# Altium schematic sheet cm4gateway.SchDoc
size D
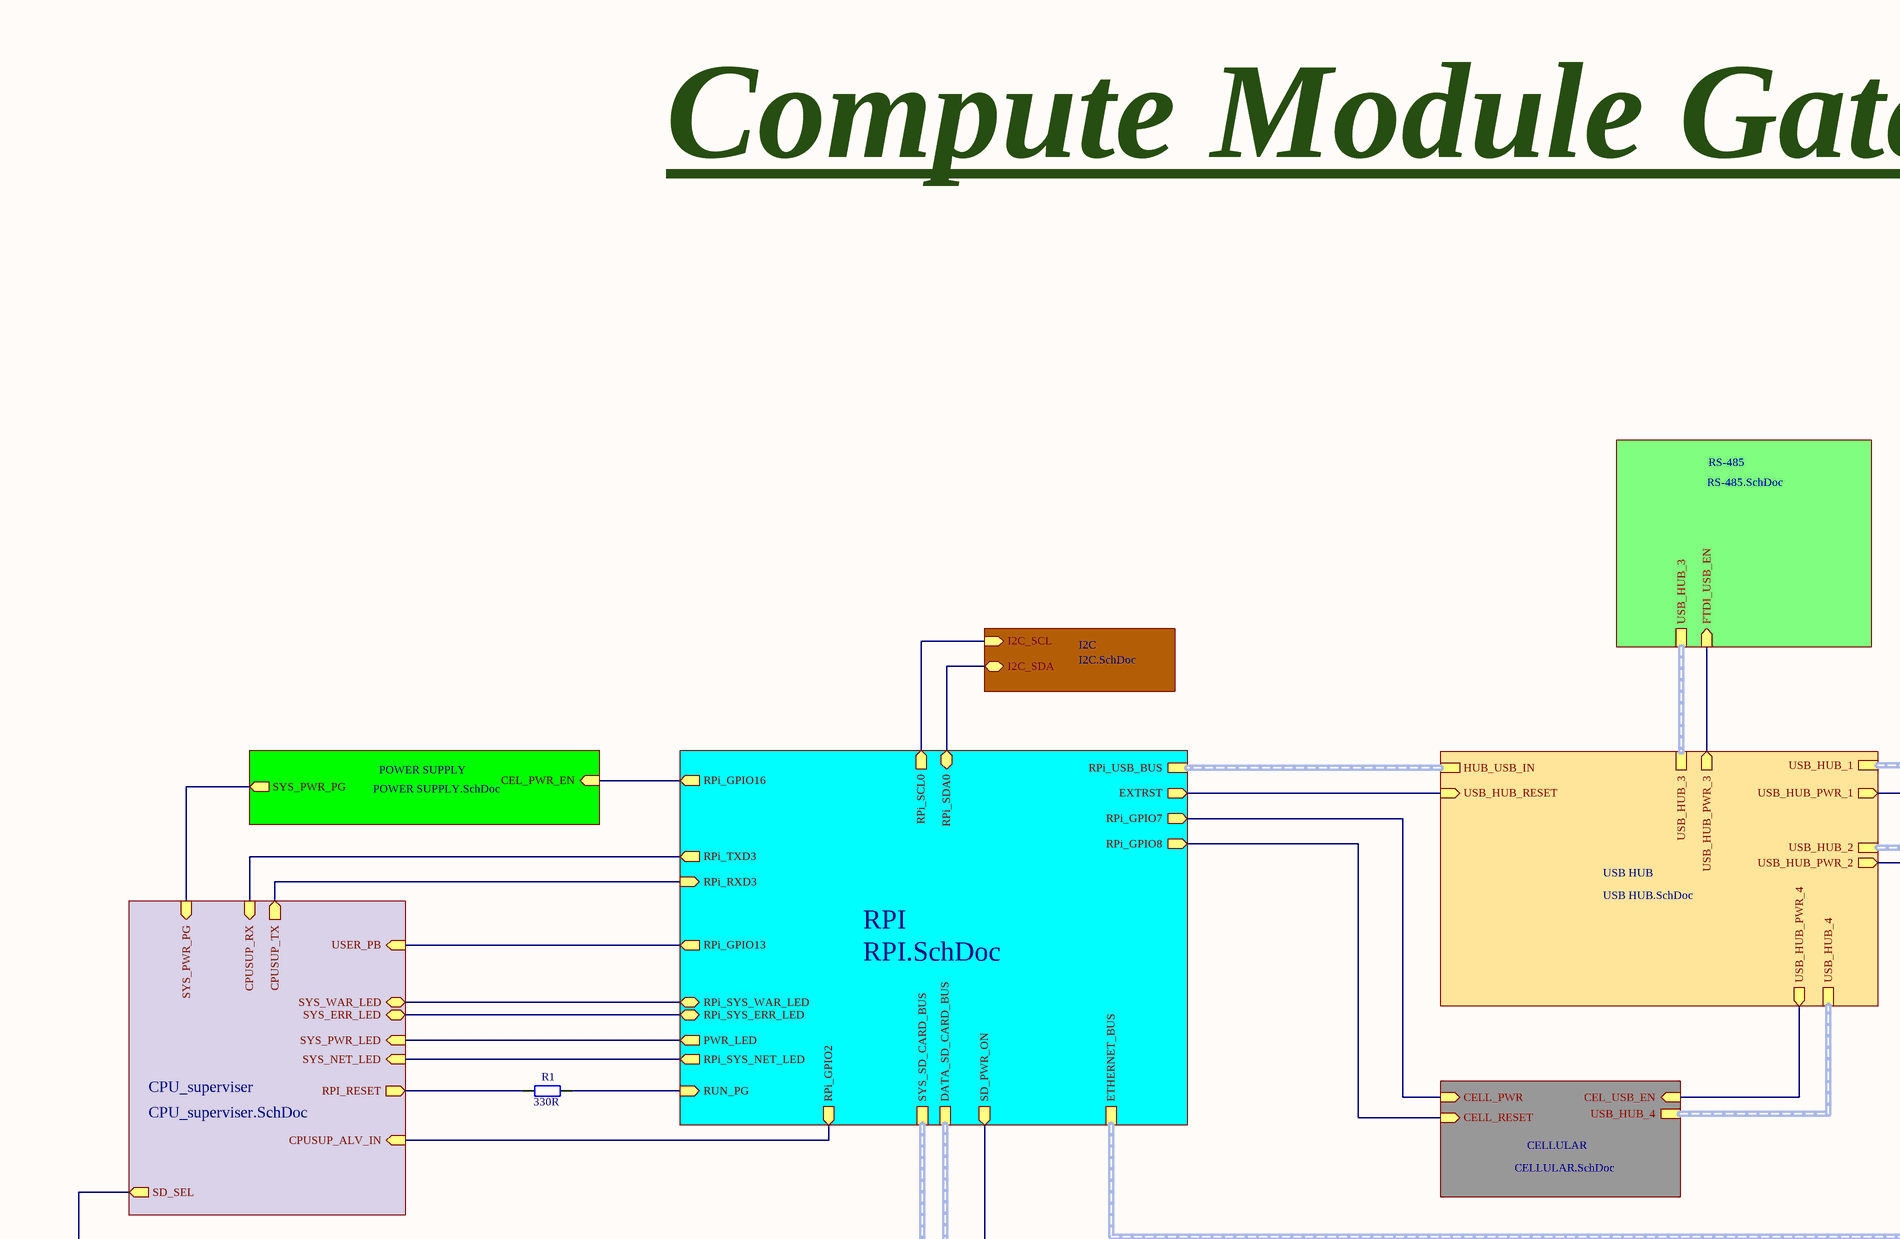
[diagram p0: cm4gateway.SchDoc, top left]
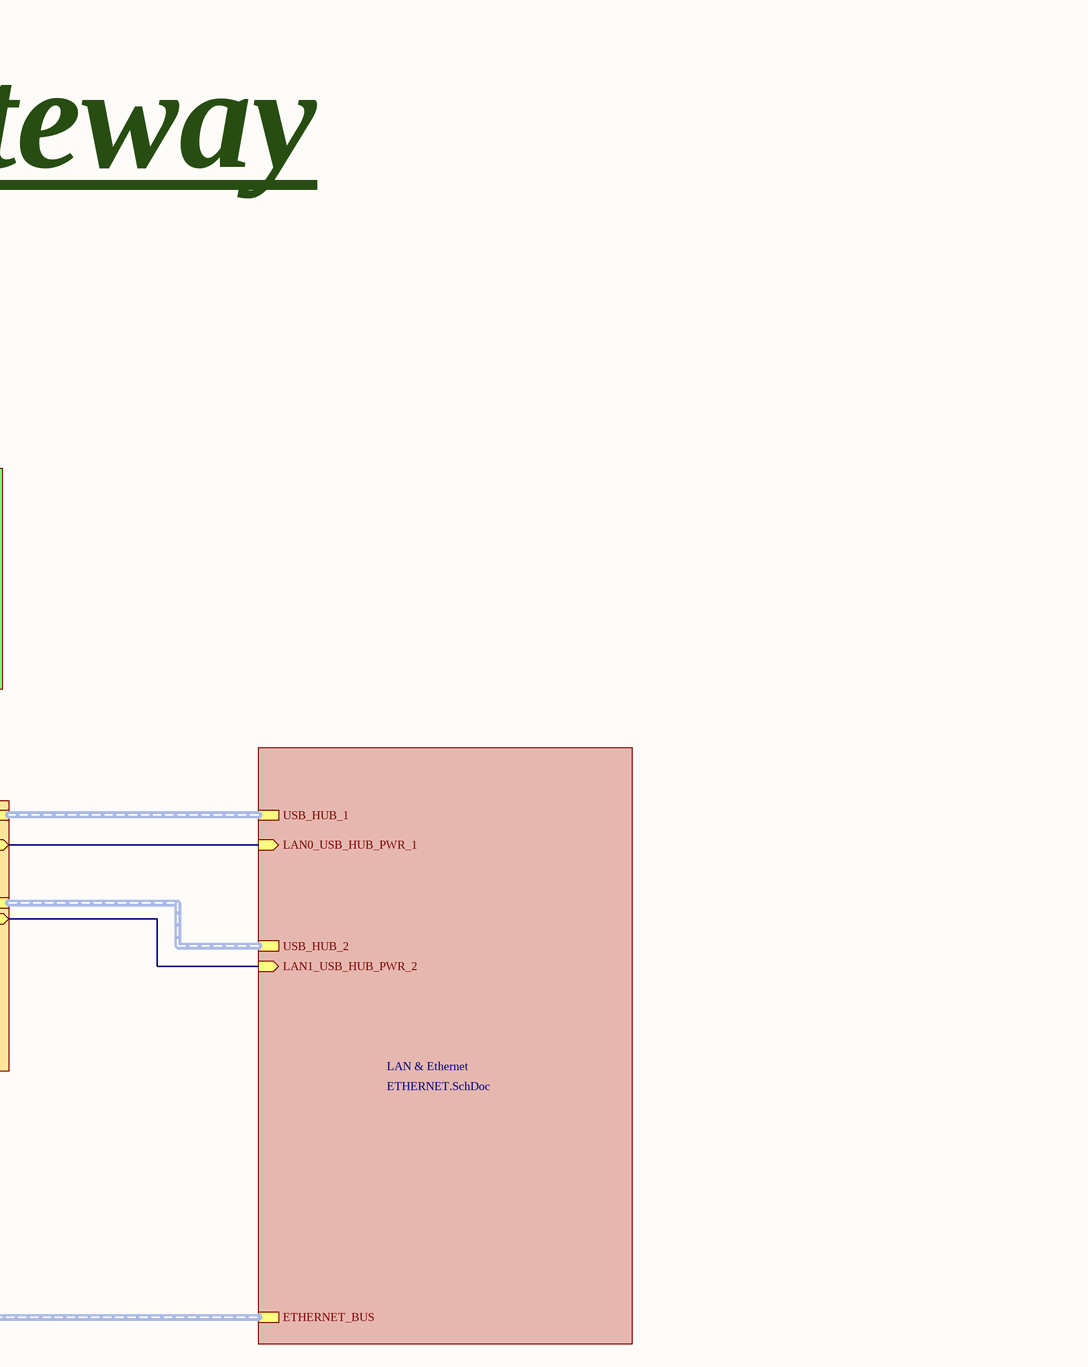
[diagram p1: cm4gateway.SchDoc, top right]
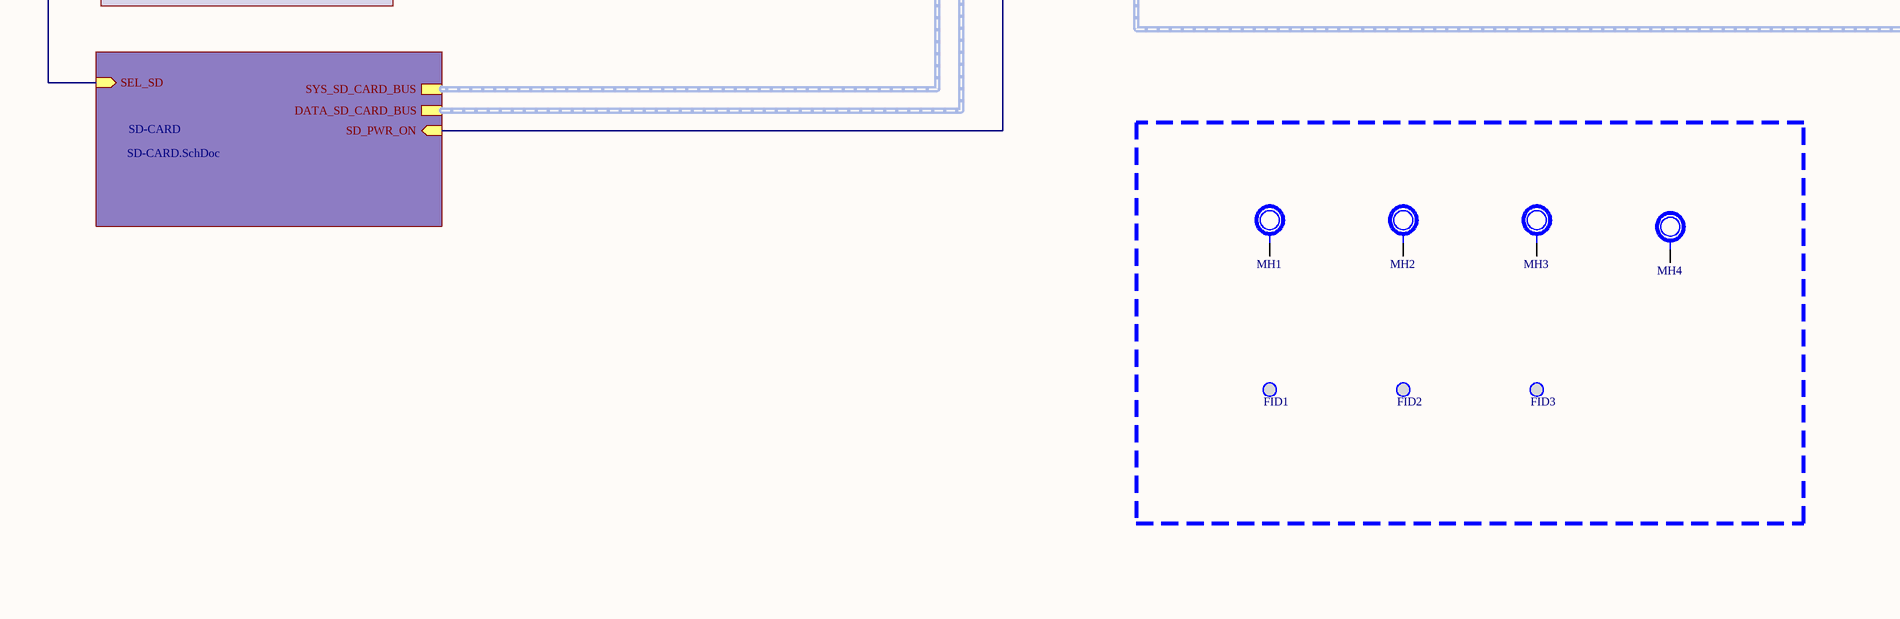
[diagram p2: cm4gateway.SchDoc, bottom left]
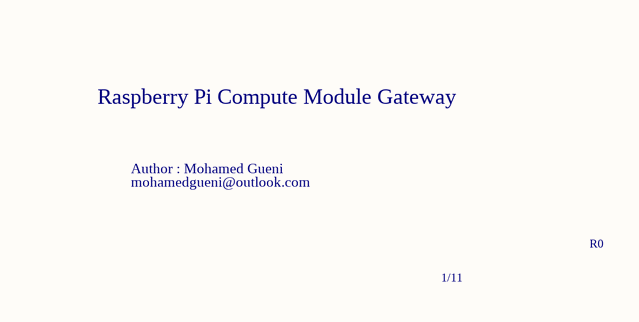
[diagram p3: cm4gateway.SchDoc, bottom right]

## Parts
FID1  Fiducial  [FIDUCIAL-1MM]  (value not drawn)
FID2  Fiducial  [FIDUCIAL-1MM]  (value not drawn)
FID3  Fiducial  [FIDUCIAL-1MM]  (value not drawn)
MH1  MH  [MH]  (value not drawn)
MH2  MH  [MH]  (value not drawn)
MH3  MH  [MH]  (value not drawn)
MH4  MH  [MH]  (value not drawn)
R1  Value 1: 330R  [RESC1608N]  (hidden comment: Resistor)

## Sub-sheets
CELLULAR = CELLULAR.SchDoc: USB_HUB_4 (harness USB_HUB_4), CEL_USB_EN (in), CELL_PWR (in), CELL_RESET (in)
CPU_superviser = CPU_superviser.SchDoc: CPUSUP_RX (in), CPUSUP_TX (out), USER_PB (in), SYS_ERR_LED (bidir), SYS_WAR_LED (bidir), CPUSUP_ALV_IN (in), RPI_RESET (out), SYS_PWR_PG (in), SD_SEL (out), SYS_PWR_LED (in), SYS_NET_LED (in)
I2C = I2C.SchDoc: I2C_SCL (in), I2C_SDA (bidir)
LAN & Ethernet = ETHERNET.SchDoc: USB_HUB_1 (harness USB_HUB_1), LAN0_USB_HUB_PWR_1 (in), USB_HUB_2 (harness USB_HUB_2), LAN1_USB_HUB_PWR_2 (in), ETHERNET_BUS (harness ETHERNET_BUS)
POWER SUPPLY = POWER SUPPLY.SchDoc: CEL_PWR_EN (in), SYS_PWR_PG (out)
RPI = RPI.SchDoc: RPi_GPIO13 (out), RPi_SYS_WAR_LED (bidir), RPi_SYS_ERR_LED (bidir), PWR_LED (out), RPi_SYS_NET_LED (out), ETHERNET_BUS (harness ETHERNET_BUS), SD_PWR_ON (out), RPi_RXD3 (in), RPi_TXD3 (out), RPi_GPIO2 (out), RUN_PG (in), RPi_GPIO16 (out), RPi_USB_BUS (harness RPi_USB_BUS), EXTRST (out), RPi_GPIO8 (out), RPi_GPIO7 (out), RPi_SDA0 (bidir), RPi_SCL0 (out), DATA_SD_CARD_BUS (harness DATA_SD_CARD_BUS), SYS_SD_CARD_BUS (harness SYS_SD_CARD_BUS)
RS-485 = RS-485.SchDoc: USB_HUB_3 (harness USB_HUB_3), FTDI_USB_EN (in)
SD-CARD = SD-CARD.SchDoc: SYS_SD_CARD_BUS (harness SYS_SD_CARD_BUS), DATA_SD_CARD_BUS (harness DATA_SD_CARD_BUS), SD_PWR_ON (in), SEL_SD (in)
USB HUB = USB HUB.SchDoc: HUB_USB_IN (harness RPi_USB_BUS), USB_HUB_RESET (in), USB_HUB_1 (harness USB_HUB_1), USB_HUB_PWR_1 (out), USB_HUB_2 (harness USB_HUB_2), USB_HUB_PWR_2 (out), USB_HUB_3 (harness USB_HUB_3), USB_HUB_PWR_3 (out), USB_HUB_4 (harness USB_HUB_4), USB_HUB_PWR_4 (out)

## Nets
NetR1_1: R1.1 ; sheet CPU_superviser/RPI_RESET
NetR1_2: R1.2 ; sheet RPI/RUN_PG
(unnamed): sheet CELLULAR/CEL_USB_EN, sheet USB HUB/USB_HUB_PWR_4
(unnamed): sheet CELLULAR/CELL_PWR, sheet RPI/RPi_GPIO7
(unnamed): sheet CELLULAR/CELL_RESET, sheet RPI/RPi_GPIO8
(unnamed): sheet USB HUB/USB_HUB_RESET, sheet RPI/EXTRST
(unnamed): sheet USB HUB/USB_HUB_PWR_1, sheet LAN & Ethernet/LAN0_USB_HUB_PWR_1
(unnamed): sheet USB HUB/USB_HUB_PWR_2, sheet LAN & Ethernet/LAN1_USB_HUB_PWR_2
(unnamed): sheet USB HUB/USB_HUB_PWR_3, sheet RS-485/FTDI_USB_EN
(unnamed): sheet POWER SUPPLY/CEL_PWR_EN, sheet RPI/RPi_GPIO16
(unnamed): sheet POWER SUPPLY/SYS_PWR_PG, sheet CPU_superviser/SYS_PWR_PG
(unnamed): sheet SD-CARD/SD_PWR_ON, sheet RPI/SD_PWR_ON
(unnamed): sheet SD-CARD/SEL_SD, sheet CPU_superviser/SD_SEL
(unnamed): sheet CPU_superviser/CPUSUP_RX, sheet RPI/RPi_TXD3
(unnamed): sheet CPU_superviser/CPUSUP_TX, sheet RPI/RPi_RXD3
(unnamed): sheet CPU_superviser/USER_PB, sheet RPI/RPi_GPIO13
(unnamed): sheet CPU_superviser/SYS_ERR_LED, sheet RPI/RPi_SYS_ERR_LED
(unnamed): sheet CPU_superviser/SYS_WAR_LED, sheet RPI/RPi_SYS_WAR_LED
(unnamed): sheet CPU_superviser/CPUSUP_ALV_IN, sheet RPI/RPi_GPIO2
(unnamed): sheet CPU_superviser/SYS_PWR_LED, sheet RPI/PWR_LED
(unnamed): sheet CPU_superviser/SYS_NET_LED, sheet RPI/RPi_SYS_NET_LED
(unnamed): sheet RPI/RPi_SDA0, sheet I2C/I2C_SDA
(unnamed): sheet RPI/RPi_SCL0, sheet I2C/I2C_SCL

Not connected (* = marked no-connect by the designer): MH1 MH; MH2 MH; MH3 MH; MH4 MH

## Buses and harness runs
harness sheet CELLULAR/USB_HUB_4 = sheet USB HUB/USB_HUB_4
harness sheet LAN & Ethernet/ETHERNET_BUS = sheet RPI/ETHERNET_BUS
harness sheet LAN & Ethernet/USB_HUB_1 = sheet USB HUB/USB_HUB_1
harness sheet LAN & Ethernet/USB_HUB_2 = sheet USB HUB/USB_HUB_2
harness sheet RPI/DATA_SD_CARD_BUS = sheet SD-CARD/DATA_SD_CARD_BUS
harness sheet RPI/RPi_USB_BUS = sheet USB HUB/HUB_USB_IN
harness sheet RPI/SYS_SD_CARD_BUS = sheet SD-CARD/SYS_SD_CARD_BUS
harness sheet RS-485/USB_HUB_3 = sheet USB HUB/USB_HUB_3

## Notes on the sheet
- Compute Module Gateway
- Raspberry Pi Compute Module Gateway
- Author : Mohamed Gueni
- mohamedgueni@outlook.com
- 1/11
- R0
- DWG. NO.
- REV.
- SHT.
- REVISION
- DESCRIPTION
- DATE
- APPROVED
- THIS DOCUMENT AND THE DATA DISCLOSED HEREIN OR HEREWITH IS THE PROPERTY OF ALTIUM LIMITED AND MAY BE FREELY DISTRIBUTED IN WHOLE. NO RIGHTS ARE RESERVED OR EXPRESS OR IMPLIED WARANTEE GIVEN.
- ENG:
- DSN:
- APPROVALS
- PROJECT
- DOCUMENT REVISION:
- DESIGN ITEM:
- CHK:
- BOM:
- REFERENCE DOCUMENTS
- PROJECT REVISION:
- TITLE
- FAB DWG:
- PCB DWG:
- ASSY DWG:
- SCALE:
- SIZE
- C
- CAGE CODE
- FILE NAME
- DWG NO.
- SHEET
- OF
- REV

## Library data of the parts
FID1-FID3 = MIS-000000003: MAN: _; Value 1: 1mm; Part Number: MIS-000000003; MANREF: _; DES: _; Value 2: _; TOL: _; FTP: _; SUP: _; SUPREF: _; NOTE: _
MH1-MH4 = MIS-000000004: MAN: _; Part Number: MIS-000000004; MANREF: _; DES: _; Value 1: _; Value 2: _; TOL: _; NOTE: _
R1 = RES-000000008: MAN: KOA Speer; SUP: Mouser; NOTE: _; Part Number: RES-000000008